# EAGLE schematic boardv2AnalogConnectors (EAGLE 6.6.0)
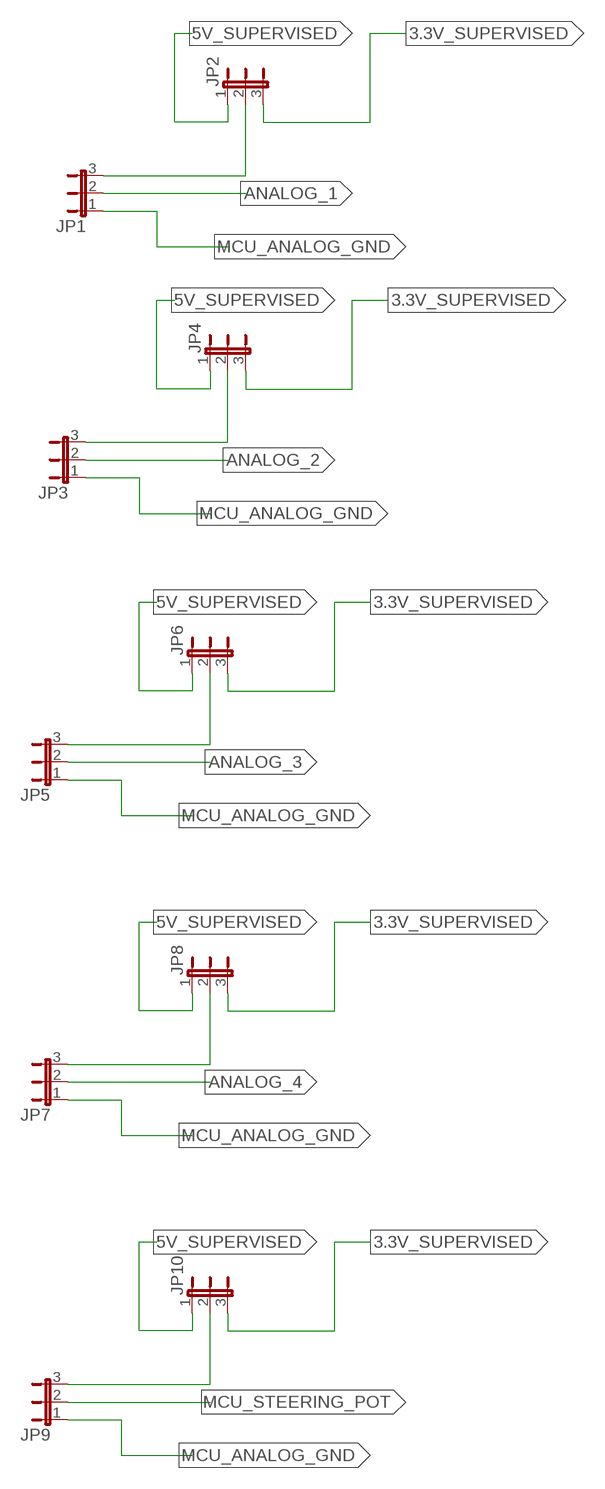
[diagram p0: schematic, sheet 1]

## Parts
JP1  JP2E  [JP2]
JP2  JP2E  [JP2]
JP3  JP2E  [JP2]
JP4  JP2E  [JP2]
JP5  JP2E  [JP2]
JP6  JP2E  [JP2]
JP7  JP2E  [JP2]
JP8  JP2E  [JP2]
JP9  JP2E  [JP2]
JP10  JP2E  [JP2]

## Nets
3.3V_SUPERVISED: JP2.3 JP4.3 JP6.3 JP8.3 JP10.3
5V_SUPERVISED: JP2.1 JP4.1 JP6.1 JP8.1 JP10.1
ANALOG_1: JP1.2
ANALOG_2: JP3.2
ANALOG_3: JP5.2
ANALOG_4: JP7.2
MCU_ANALOG_GND: JP1.1 JP3.1 JP5.1 JP7.1 JP9.1
MCU_STEERING_POT: JP9.2
N$1: JP1.3 JP2.2
N$2: JP3.3 JP4.2
N$3: JP5.3 JP6.2
N$4: JP7.3 JP8.2
N$5: JP9.3 JP10.2

## Library data of the parts
JP1-JP10 = jumper:JP2E: JUMPER